# EAGLE schematic 612_jetracer_328_020022 (EAGLE 9.6.2)
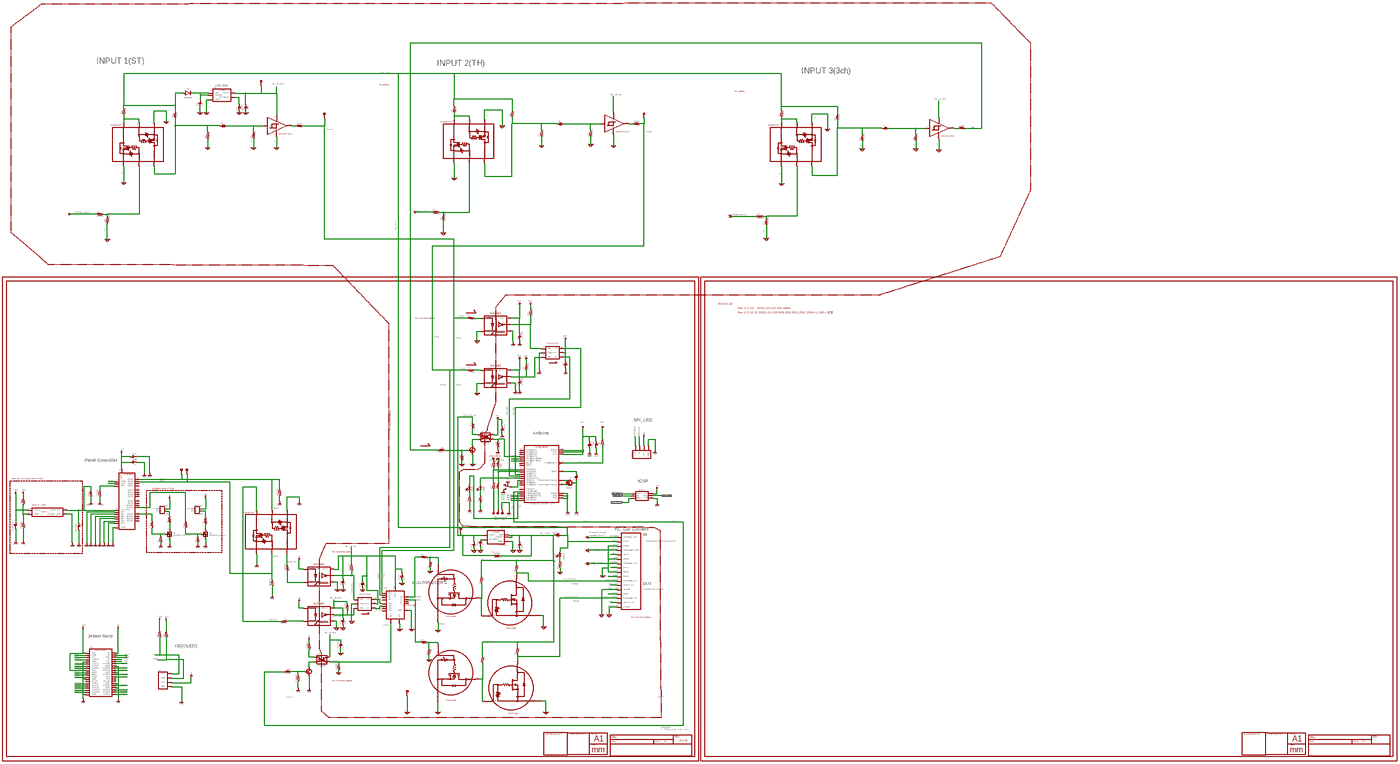
[diagram p0: schematic, sheet 1, overview]
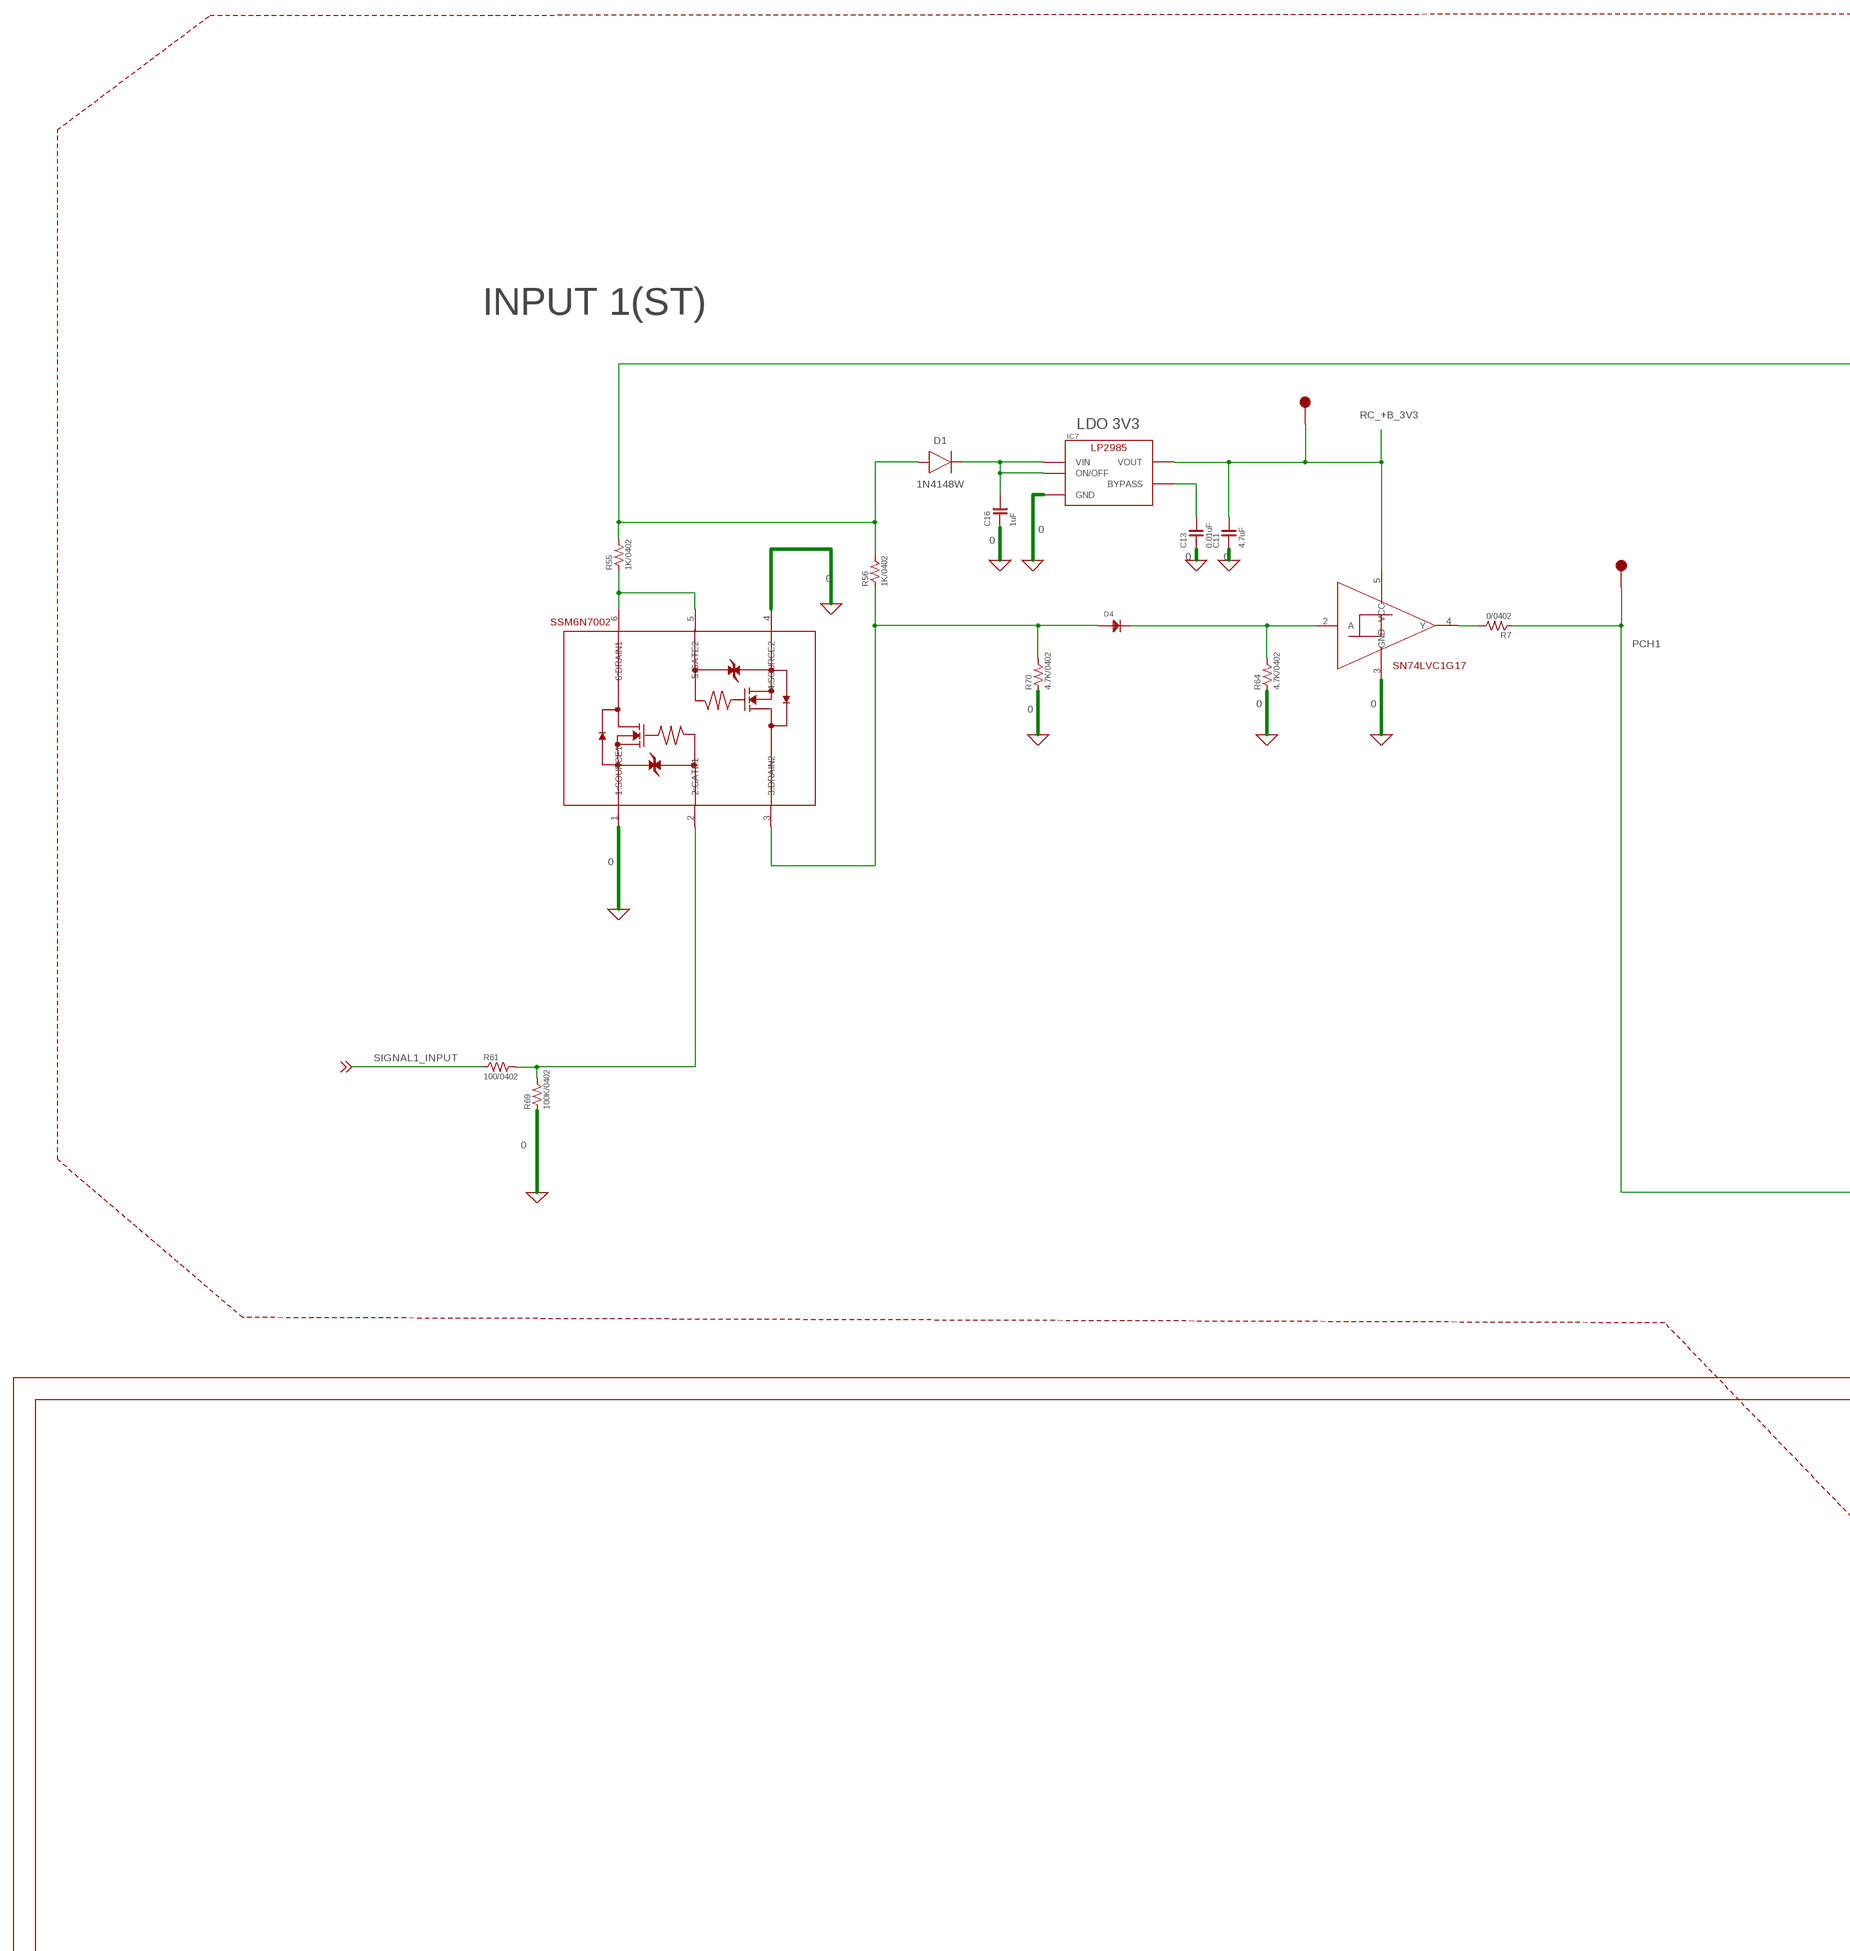
[diagram p1: schematic, sheet 1, part 1 of 8]
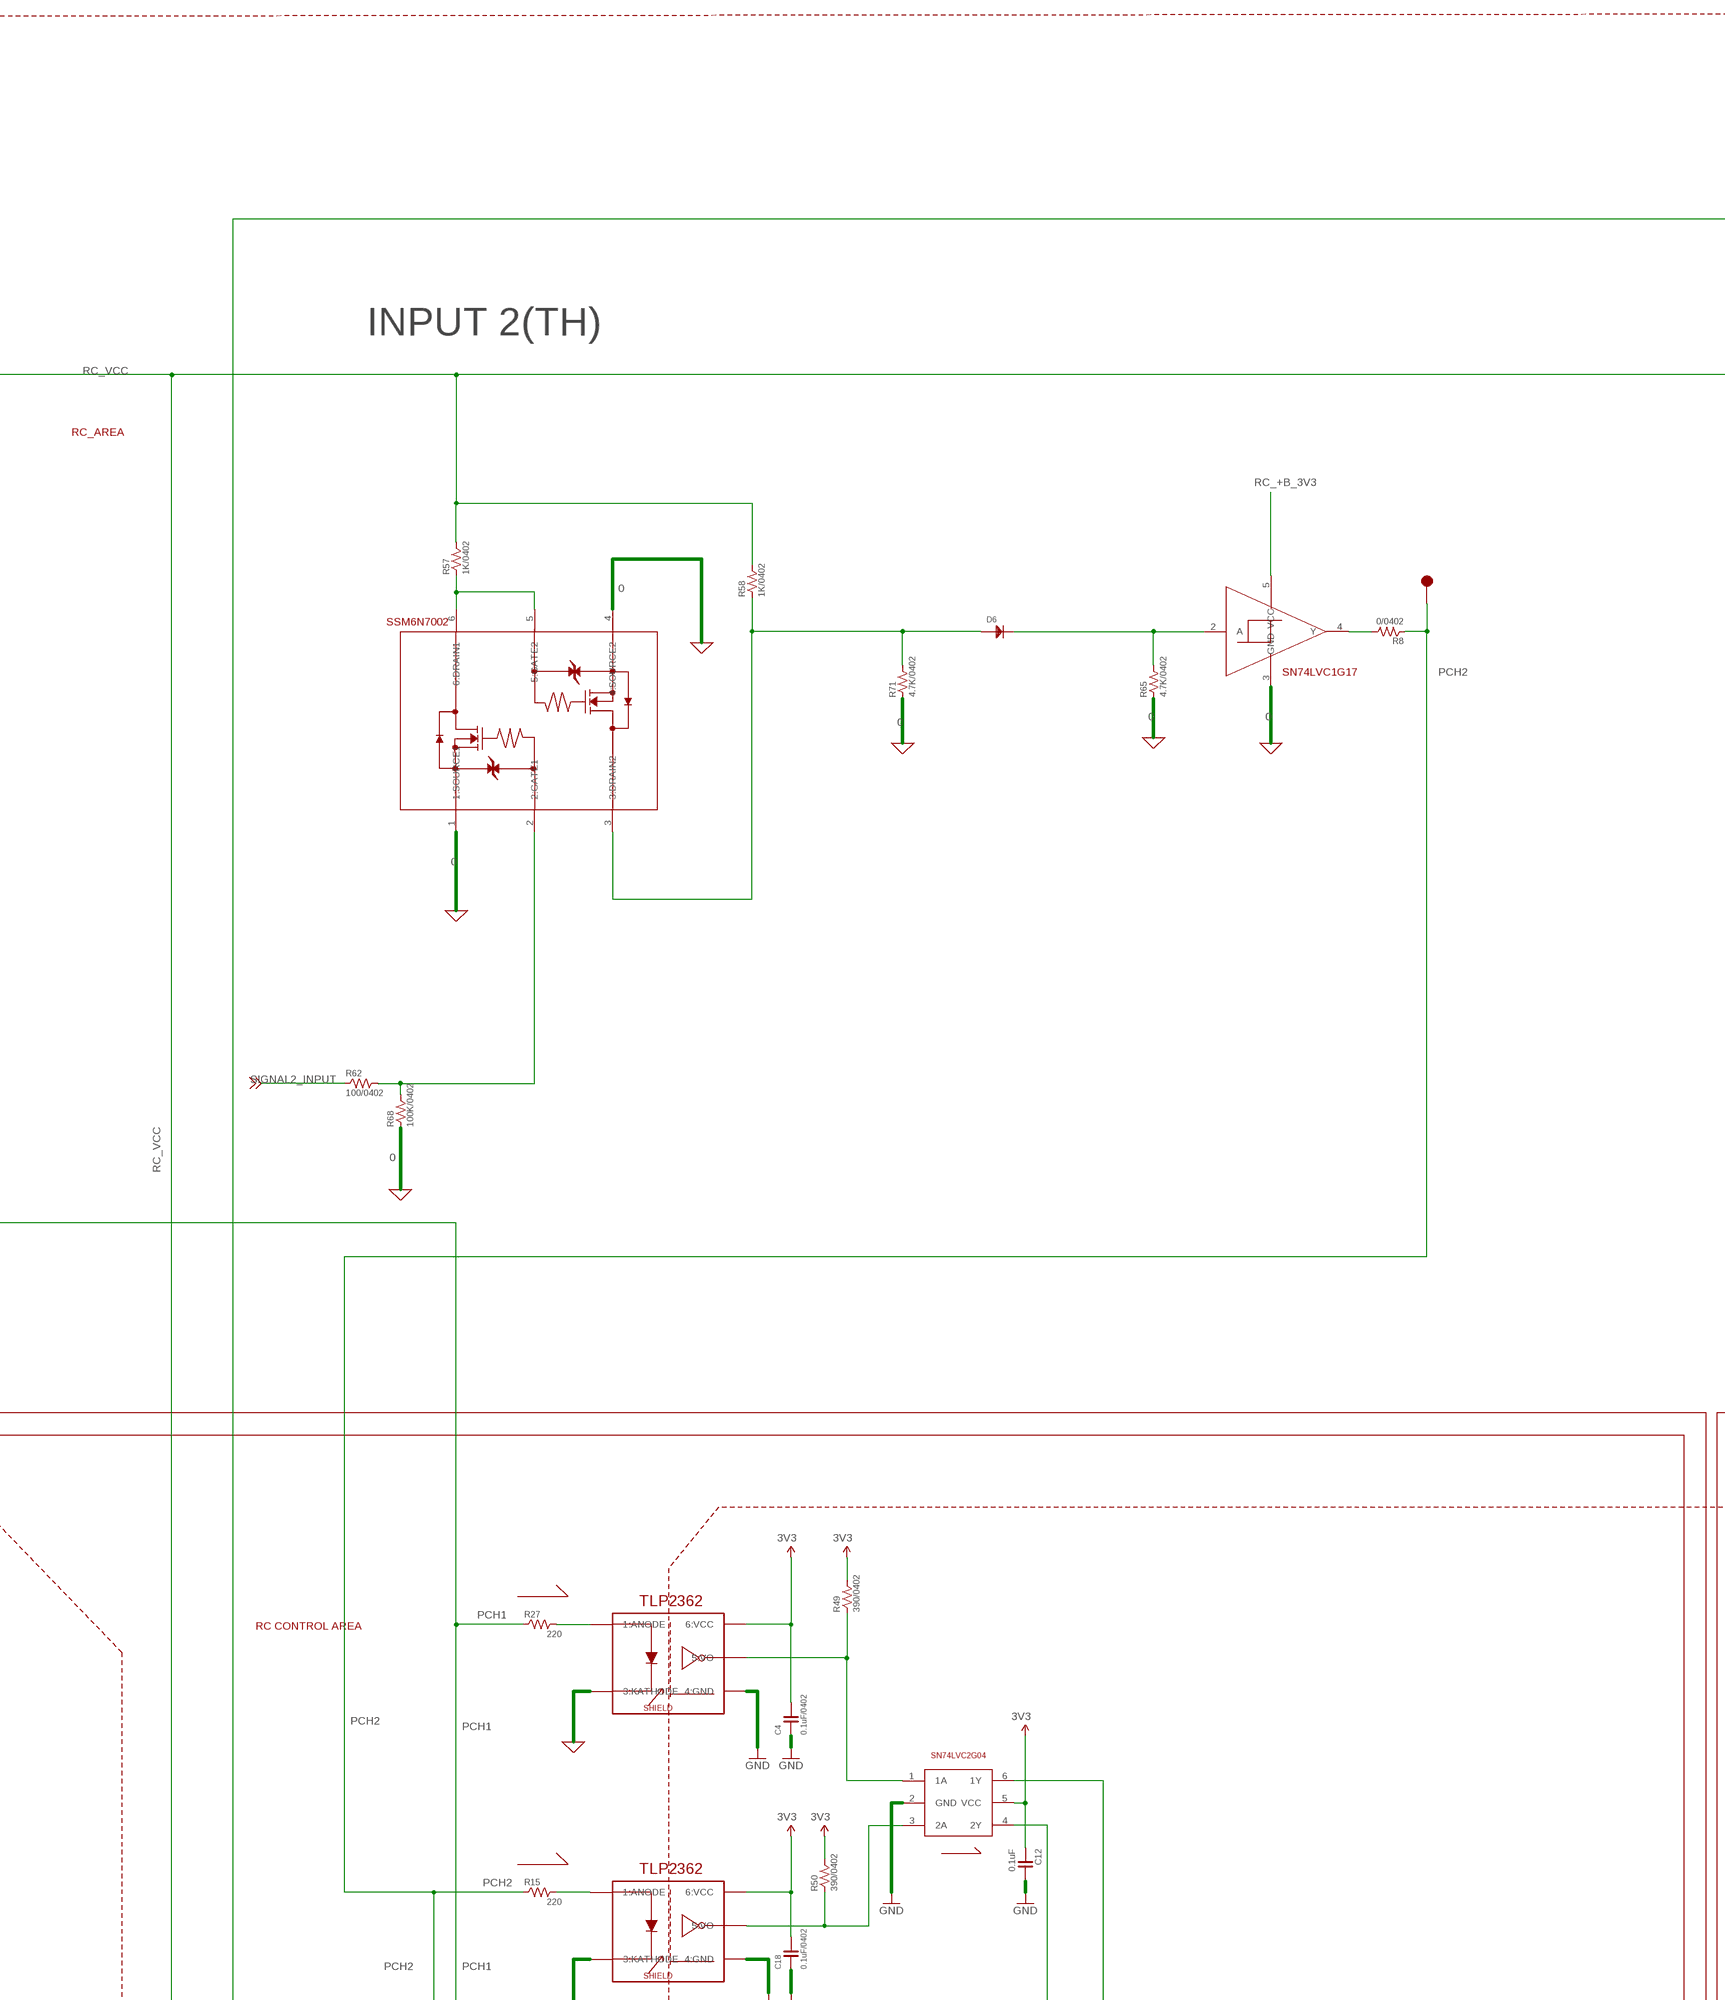
[diagram p2: schematic, sheet 1, part 2 of 8]
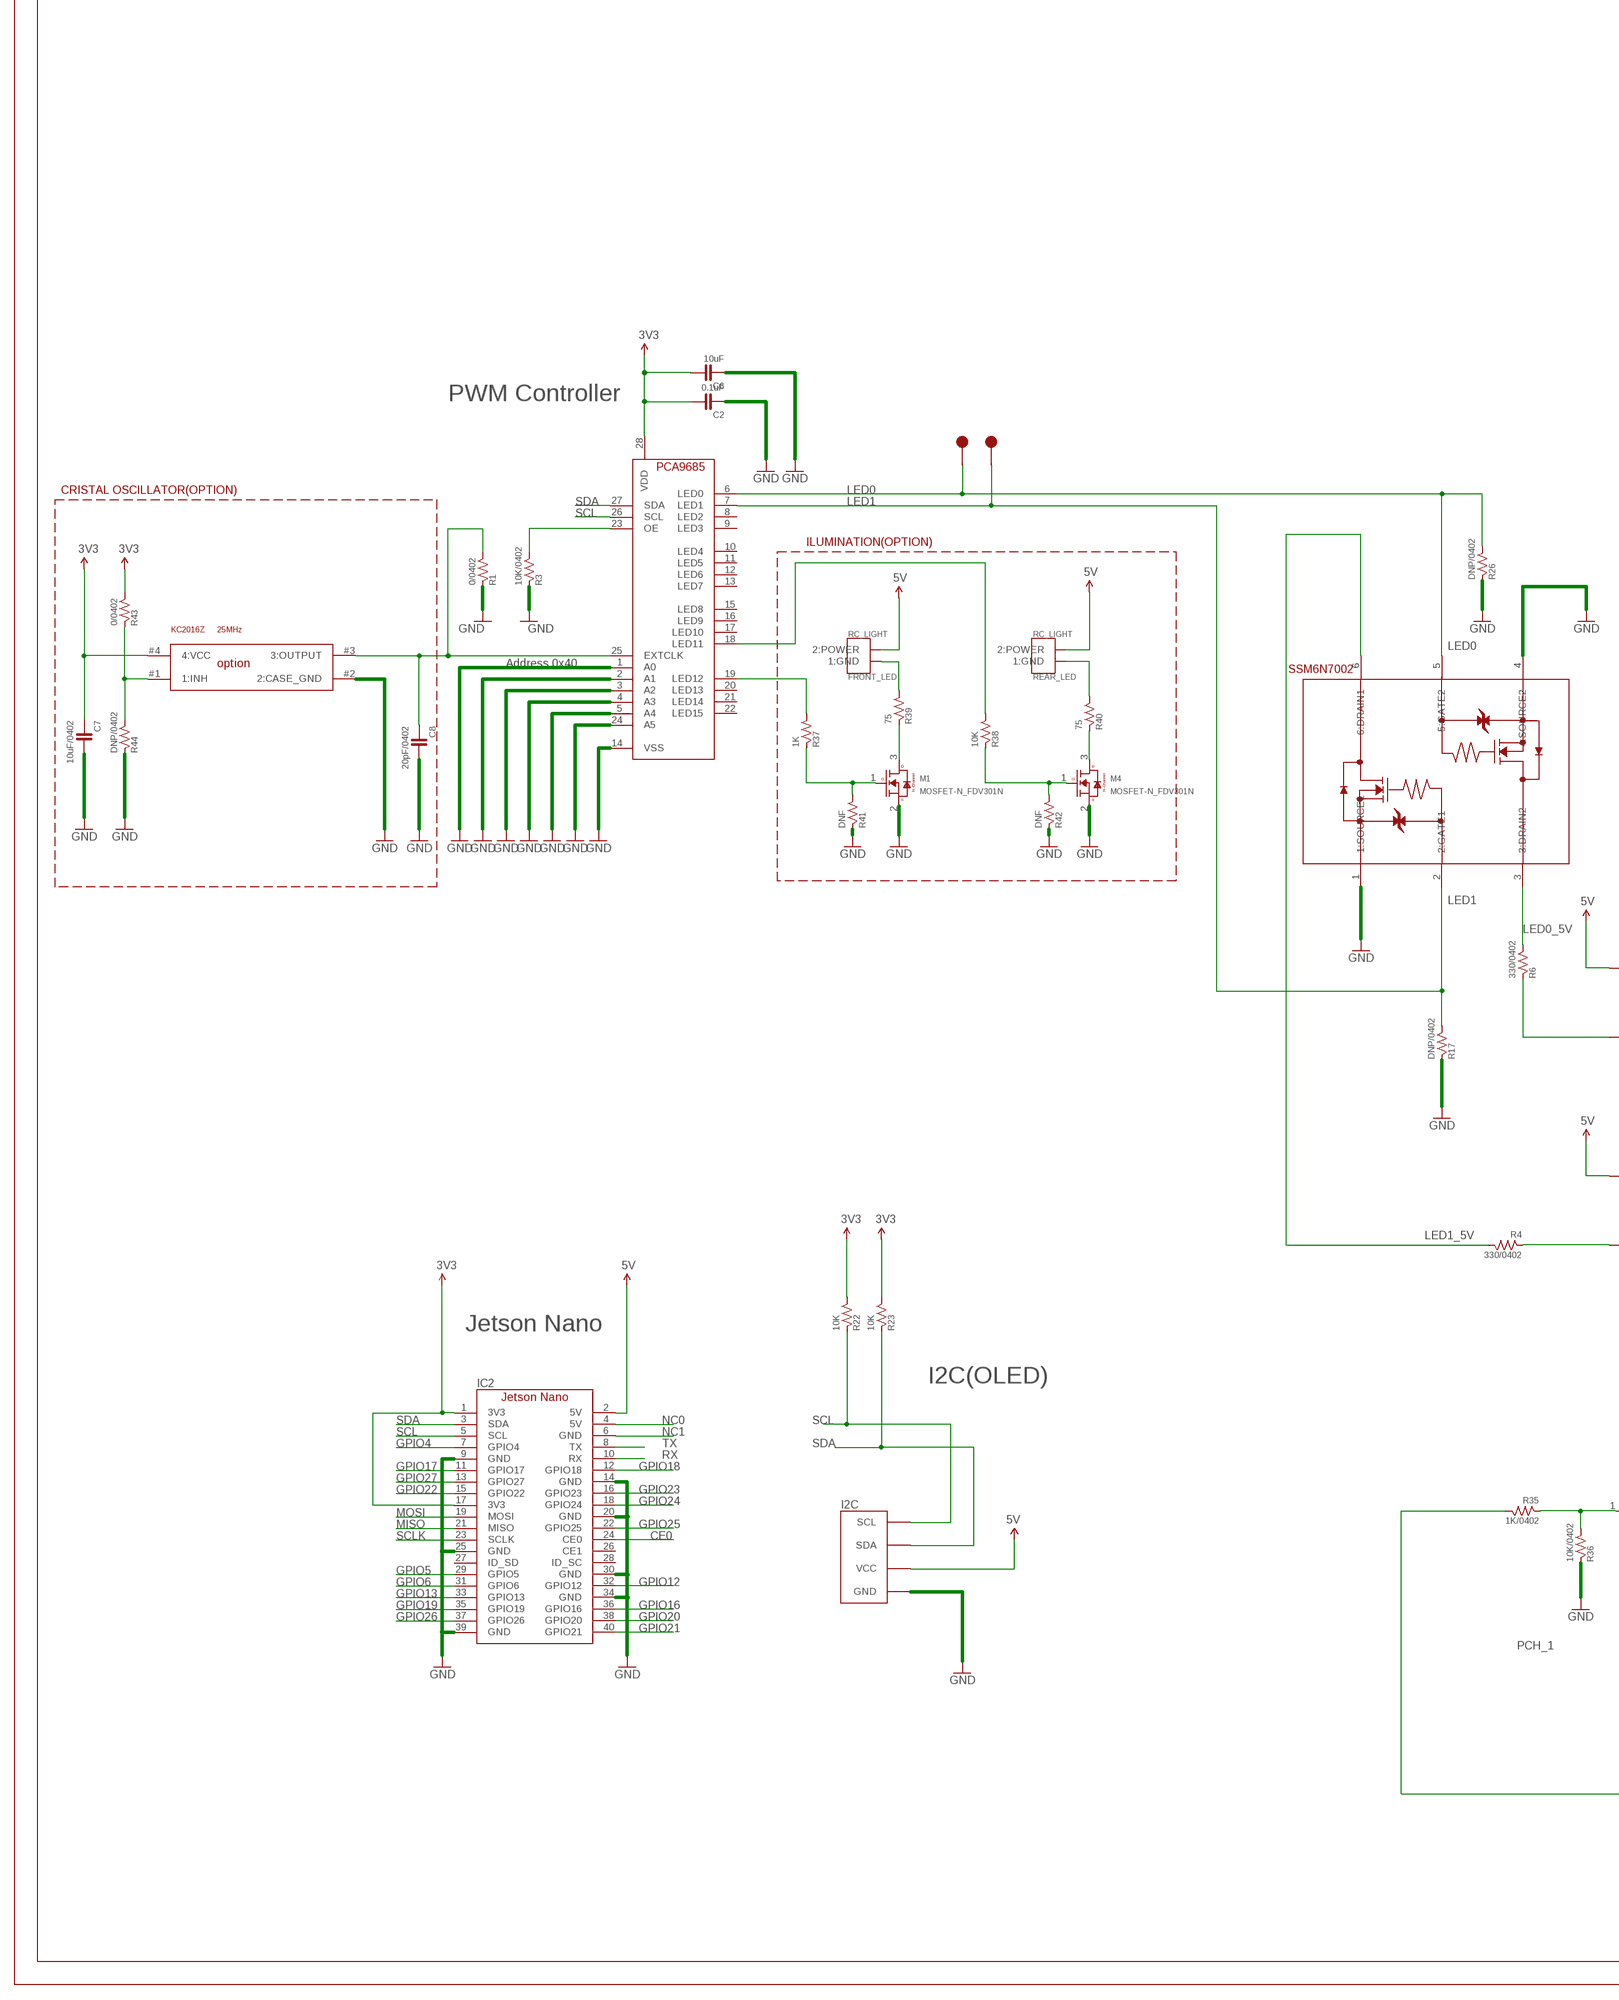
[diagram p3: schematic, sheet 1, part 3 of 8]
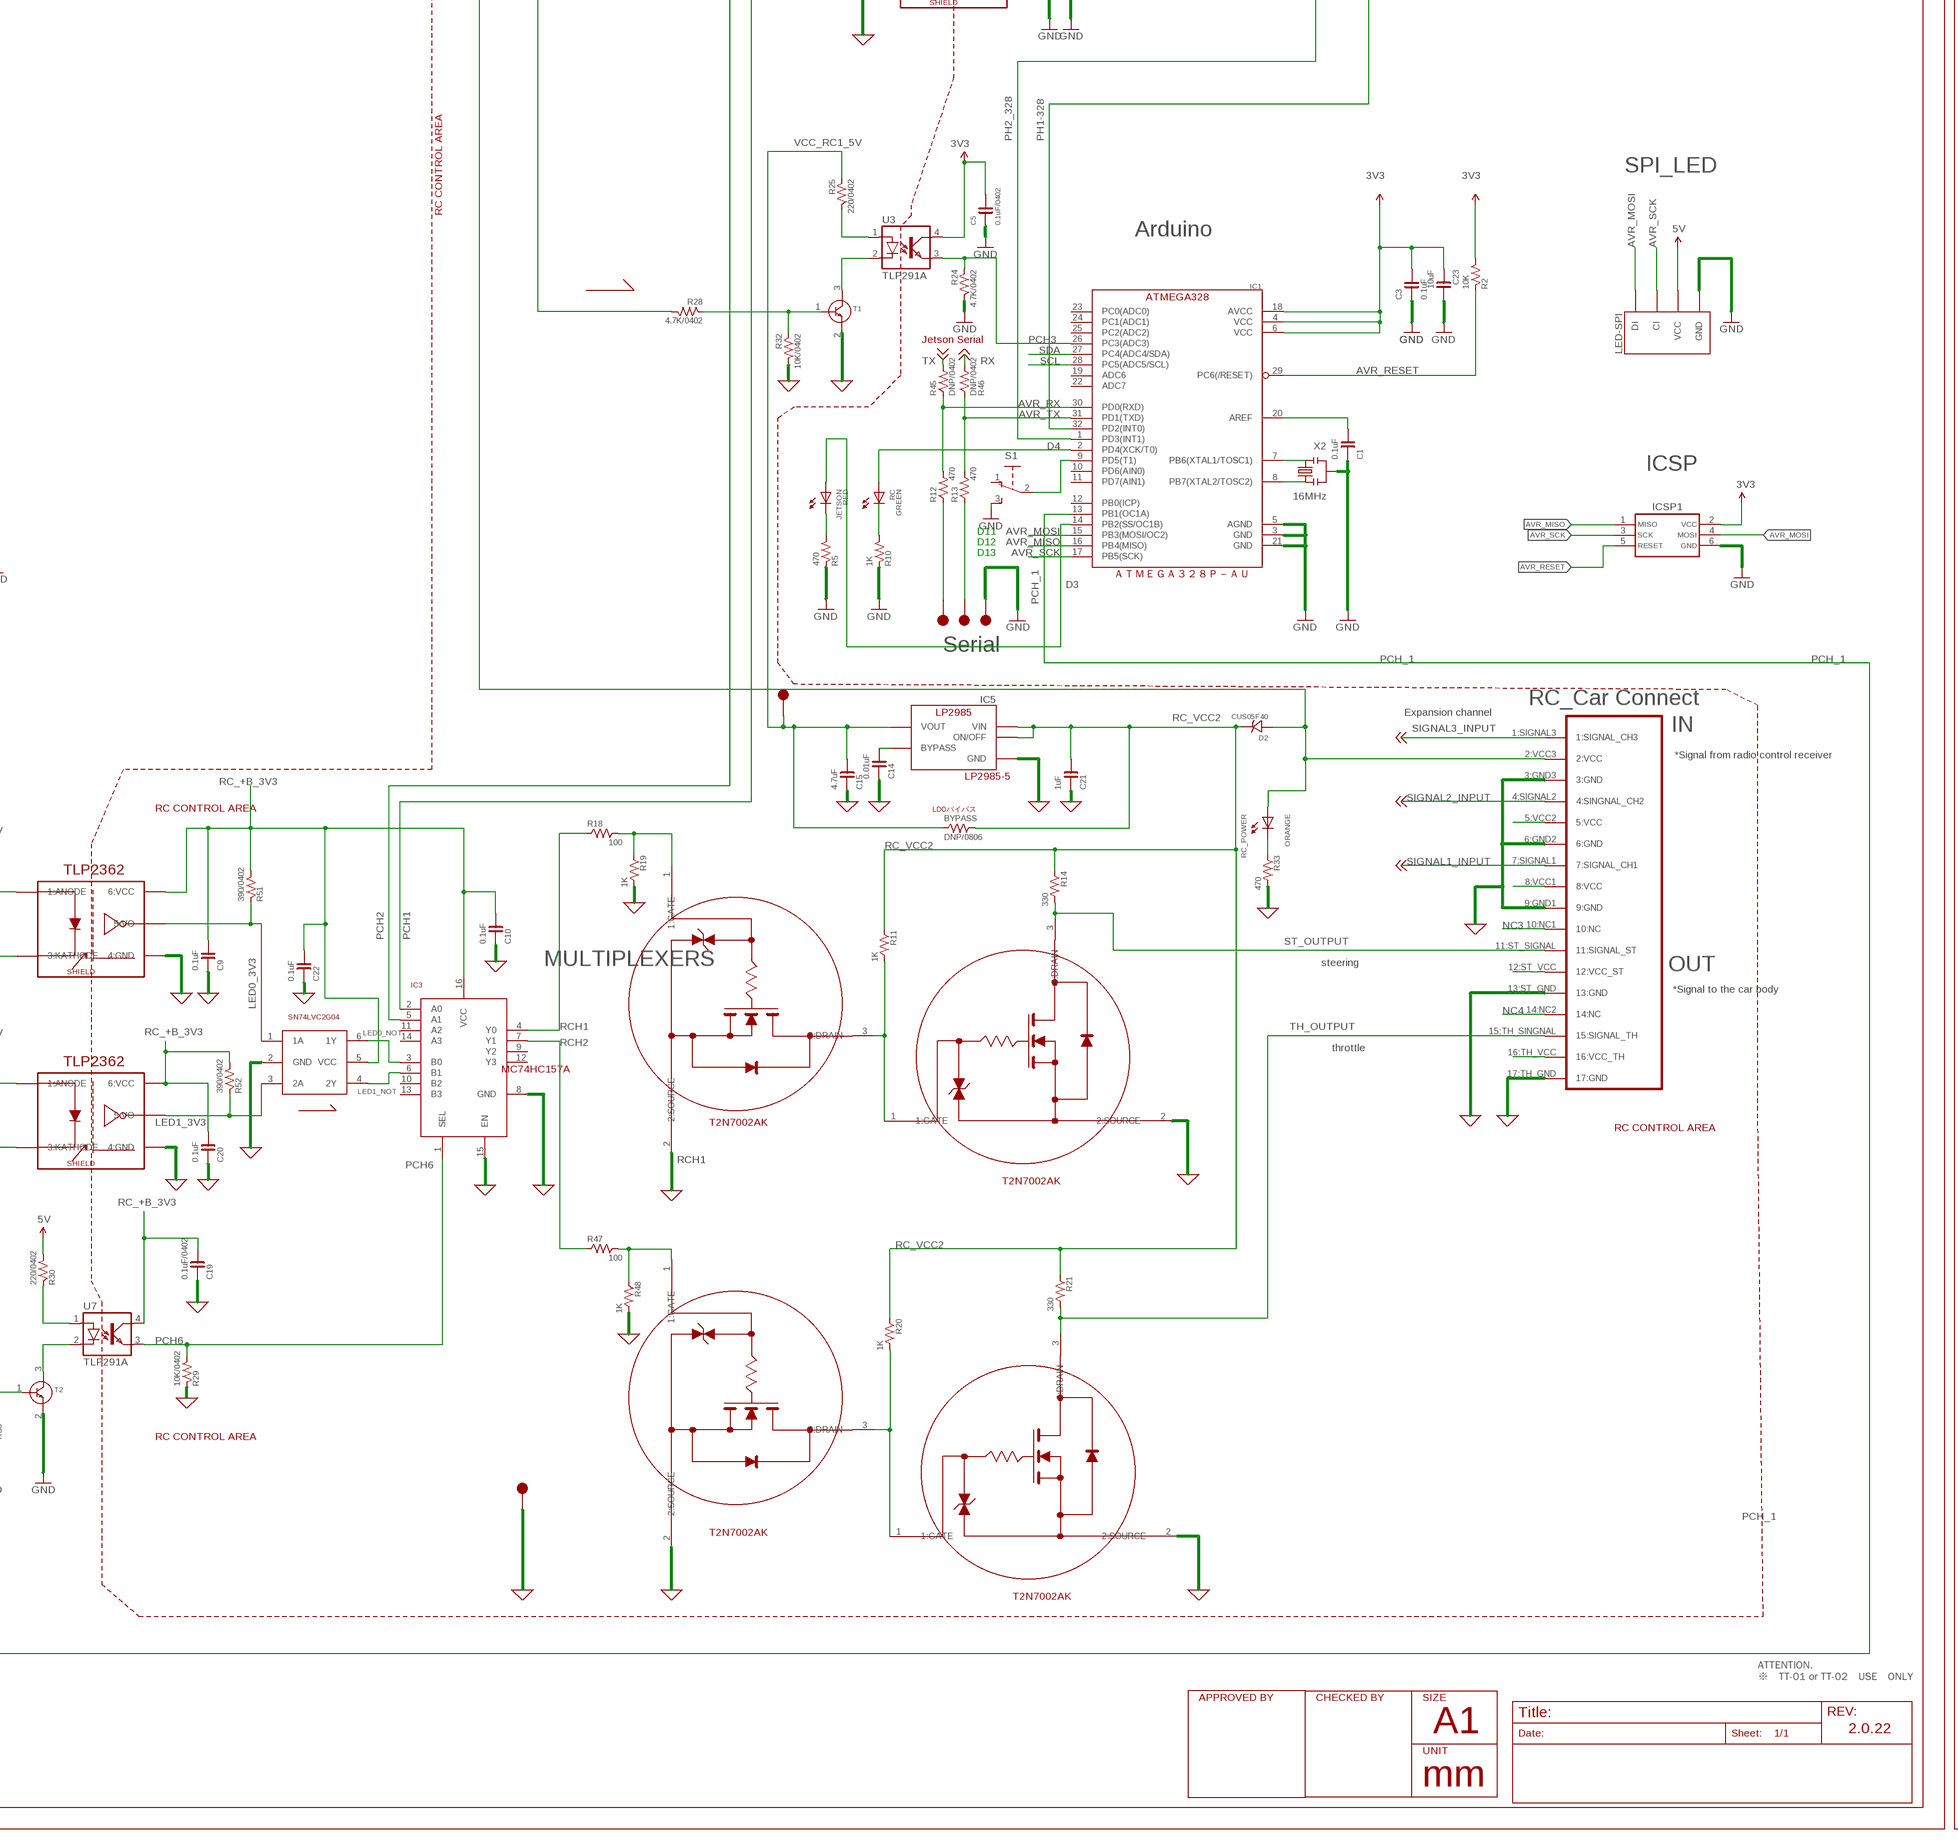
[diagram p4: schematic, sheet 1, part 4 of 8]
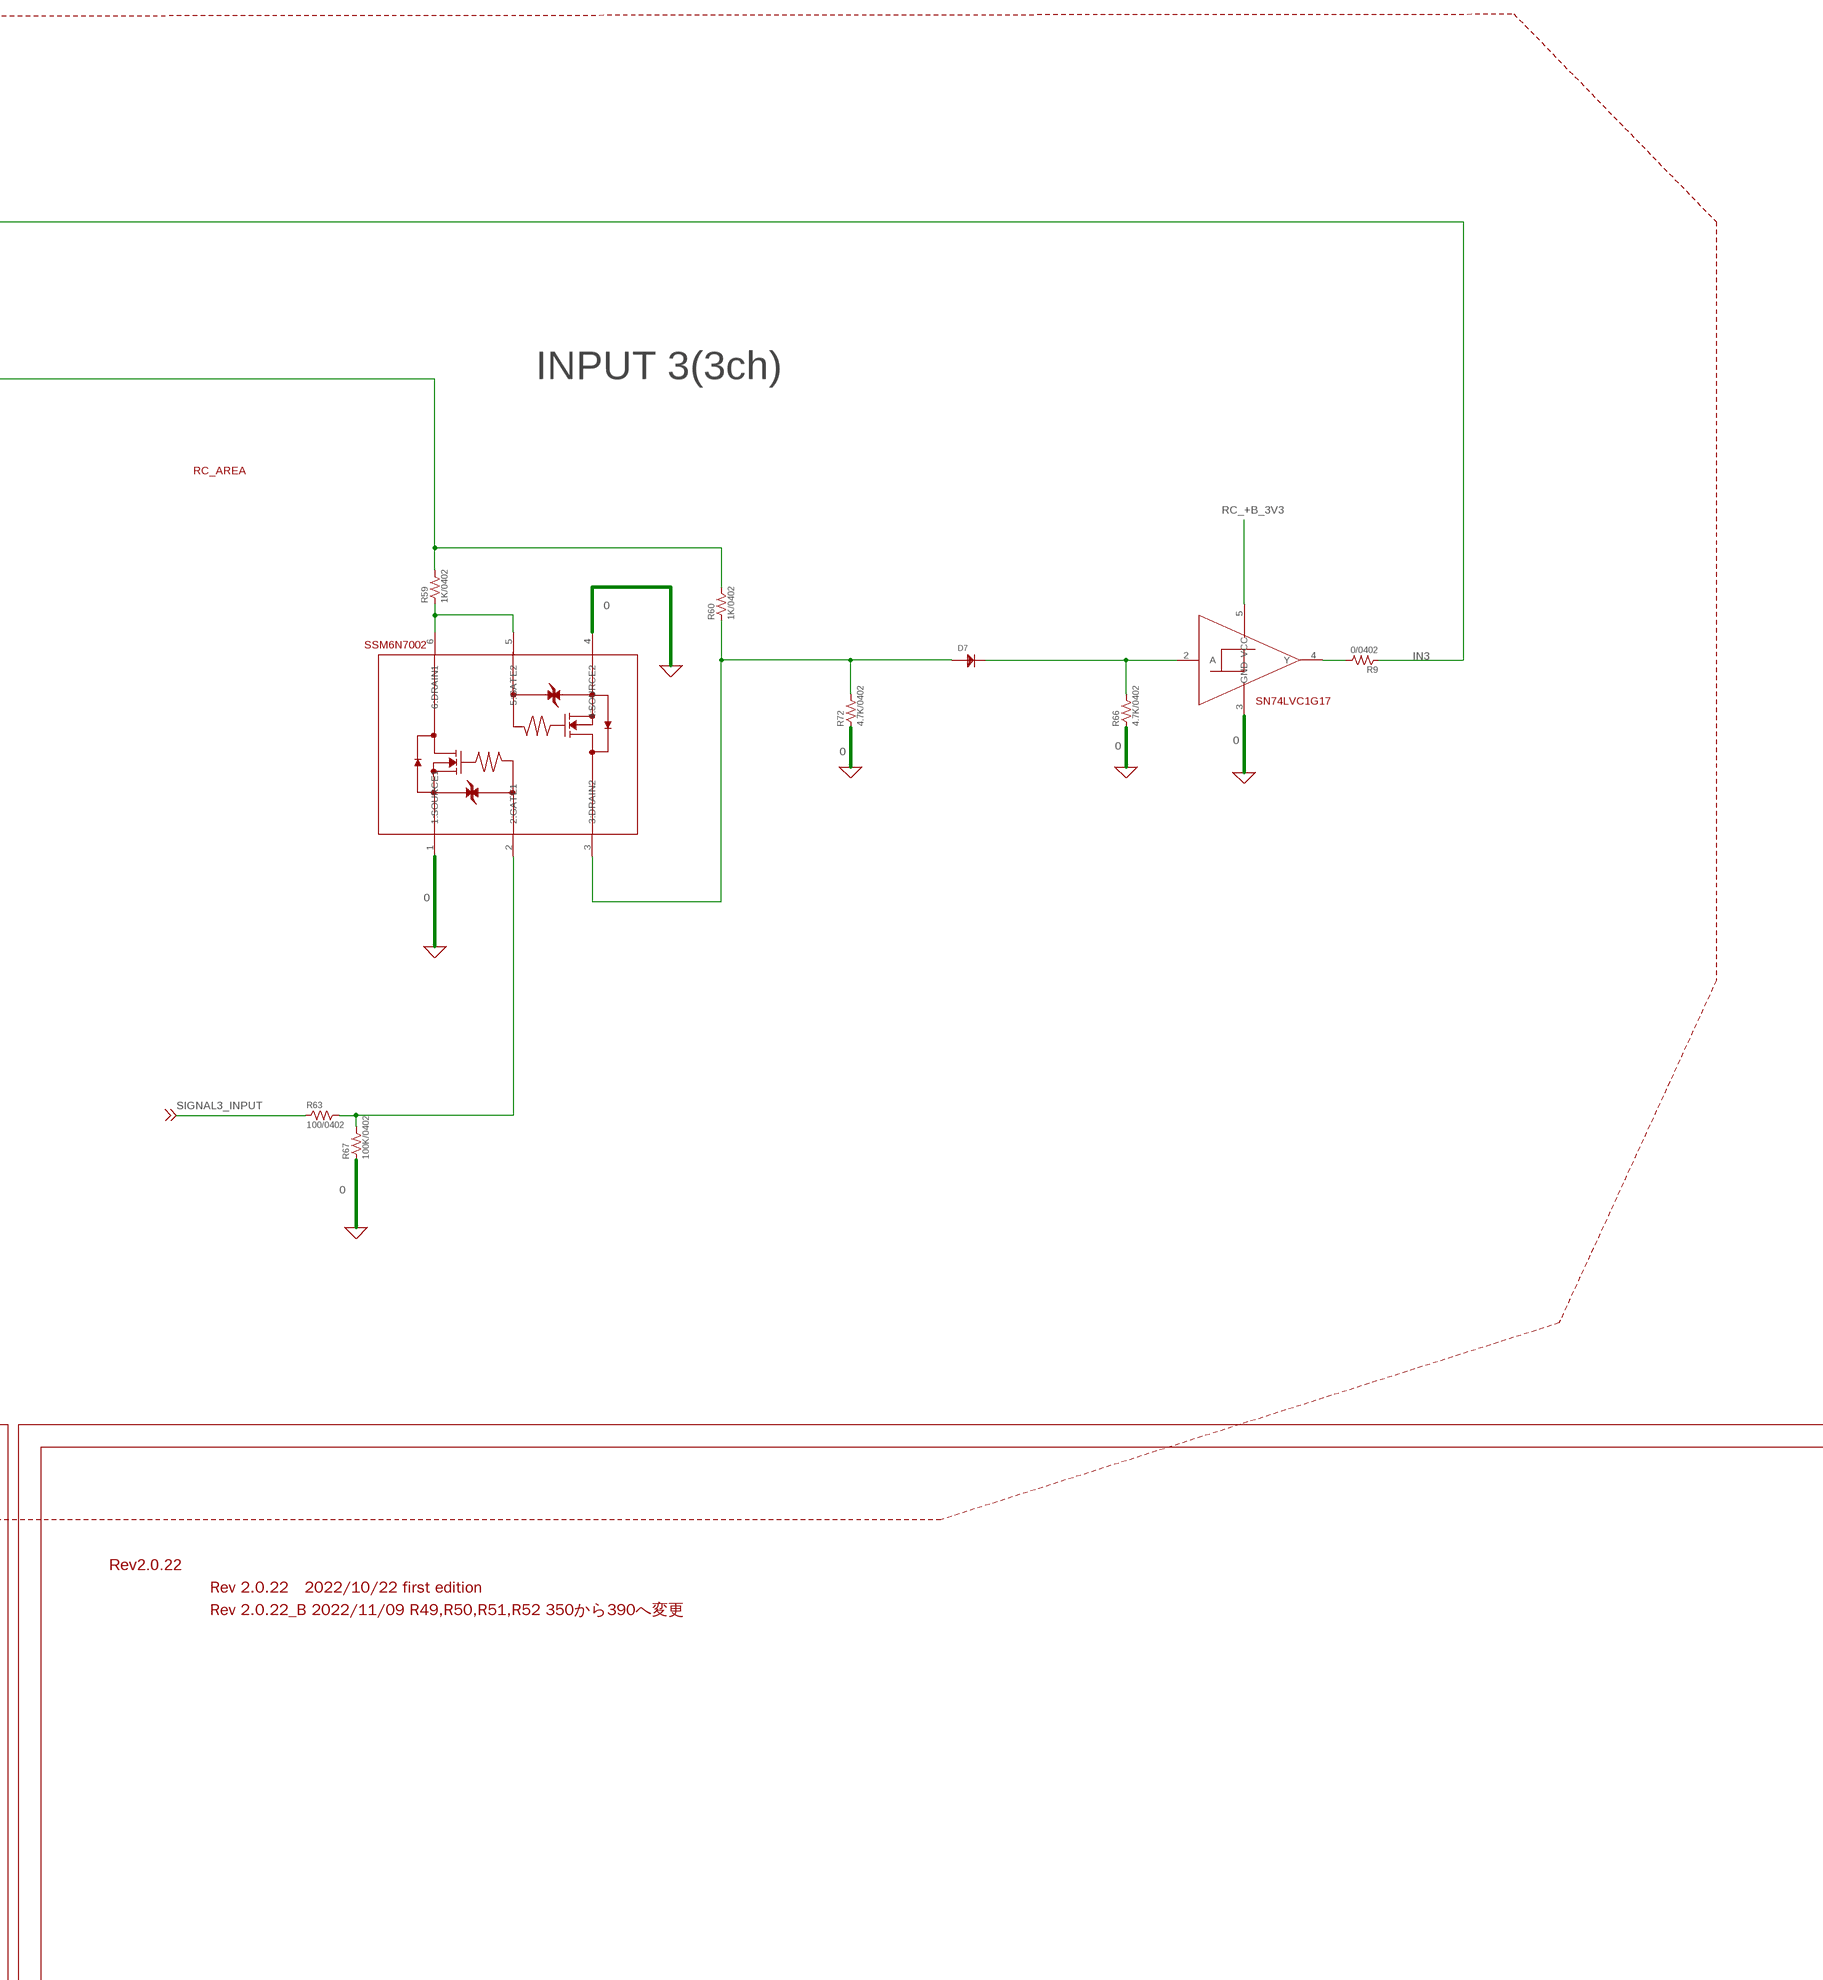
[diagram p5: schematic, sheet 1, part 5 of 8]
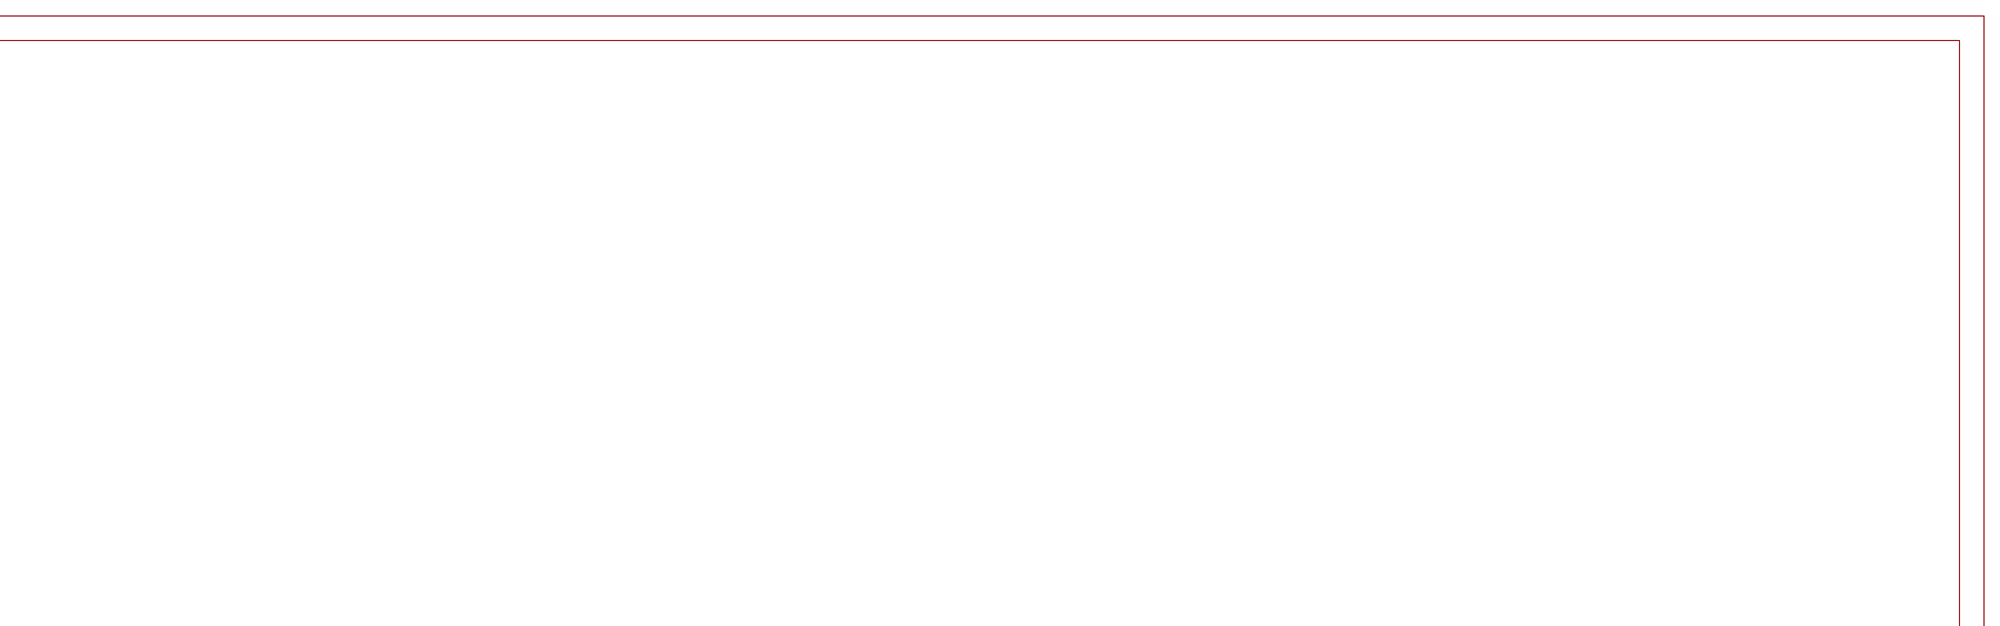
[diagram p6: schematic, sheet 1, part 6 of 8]
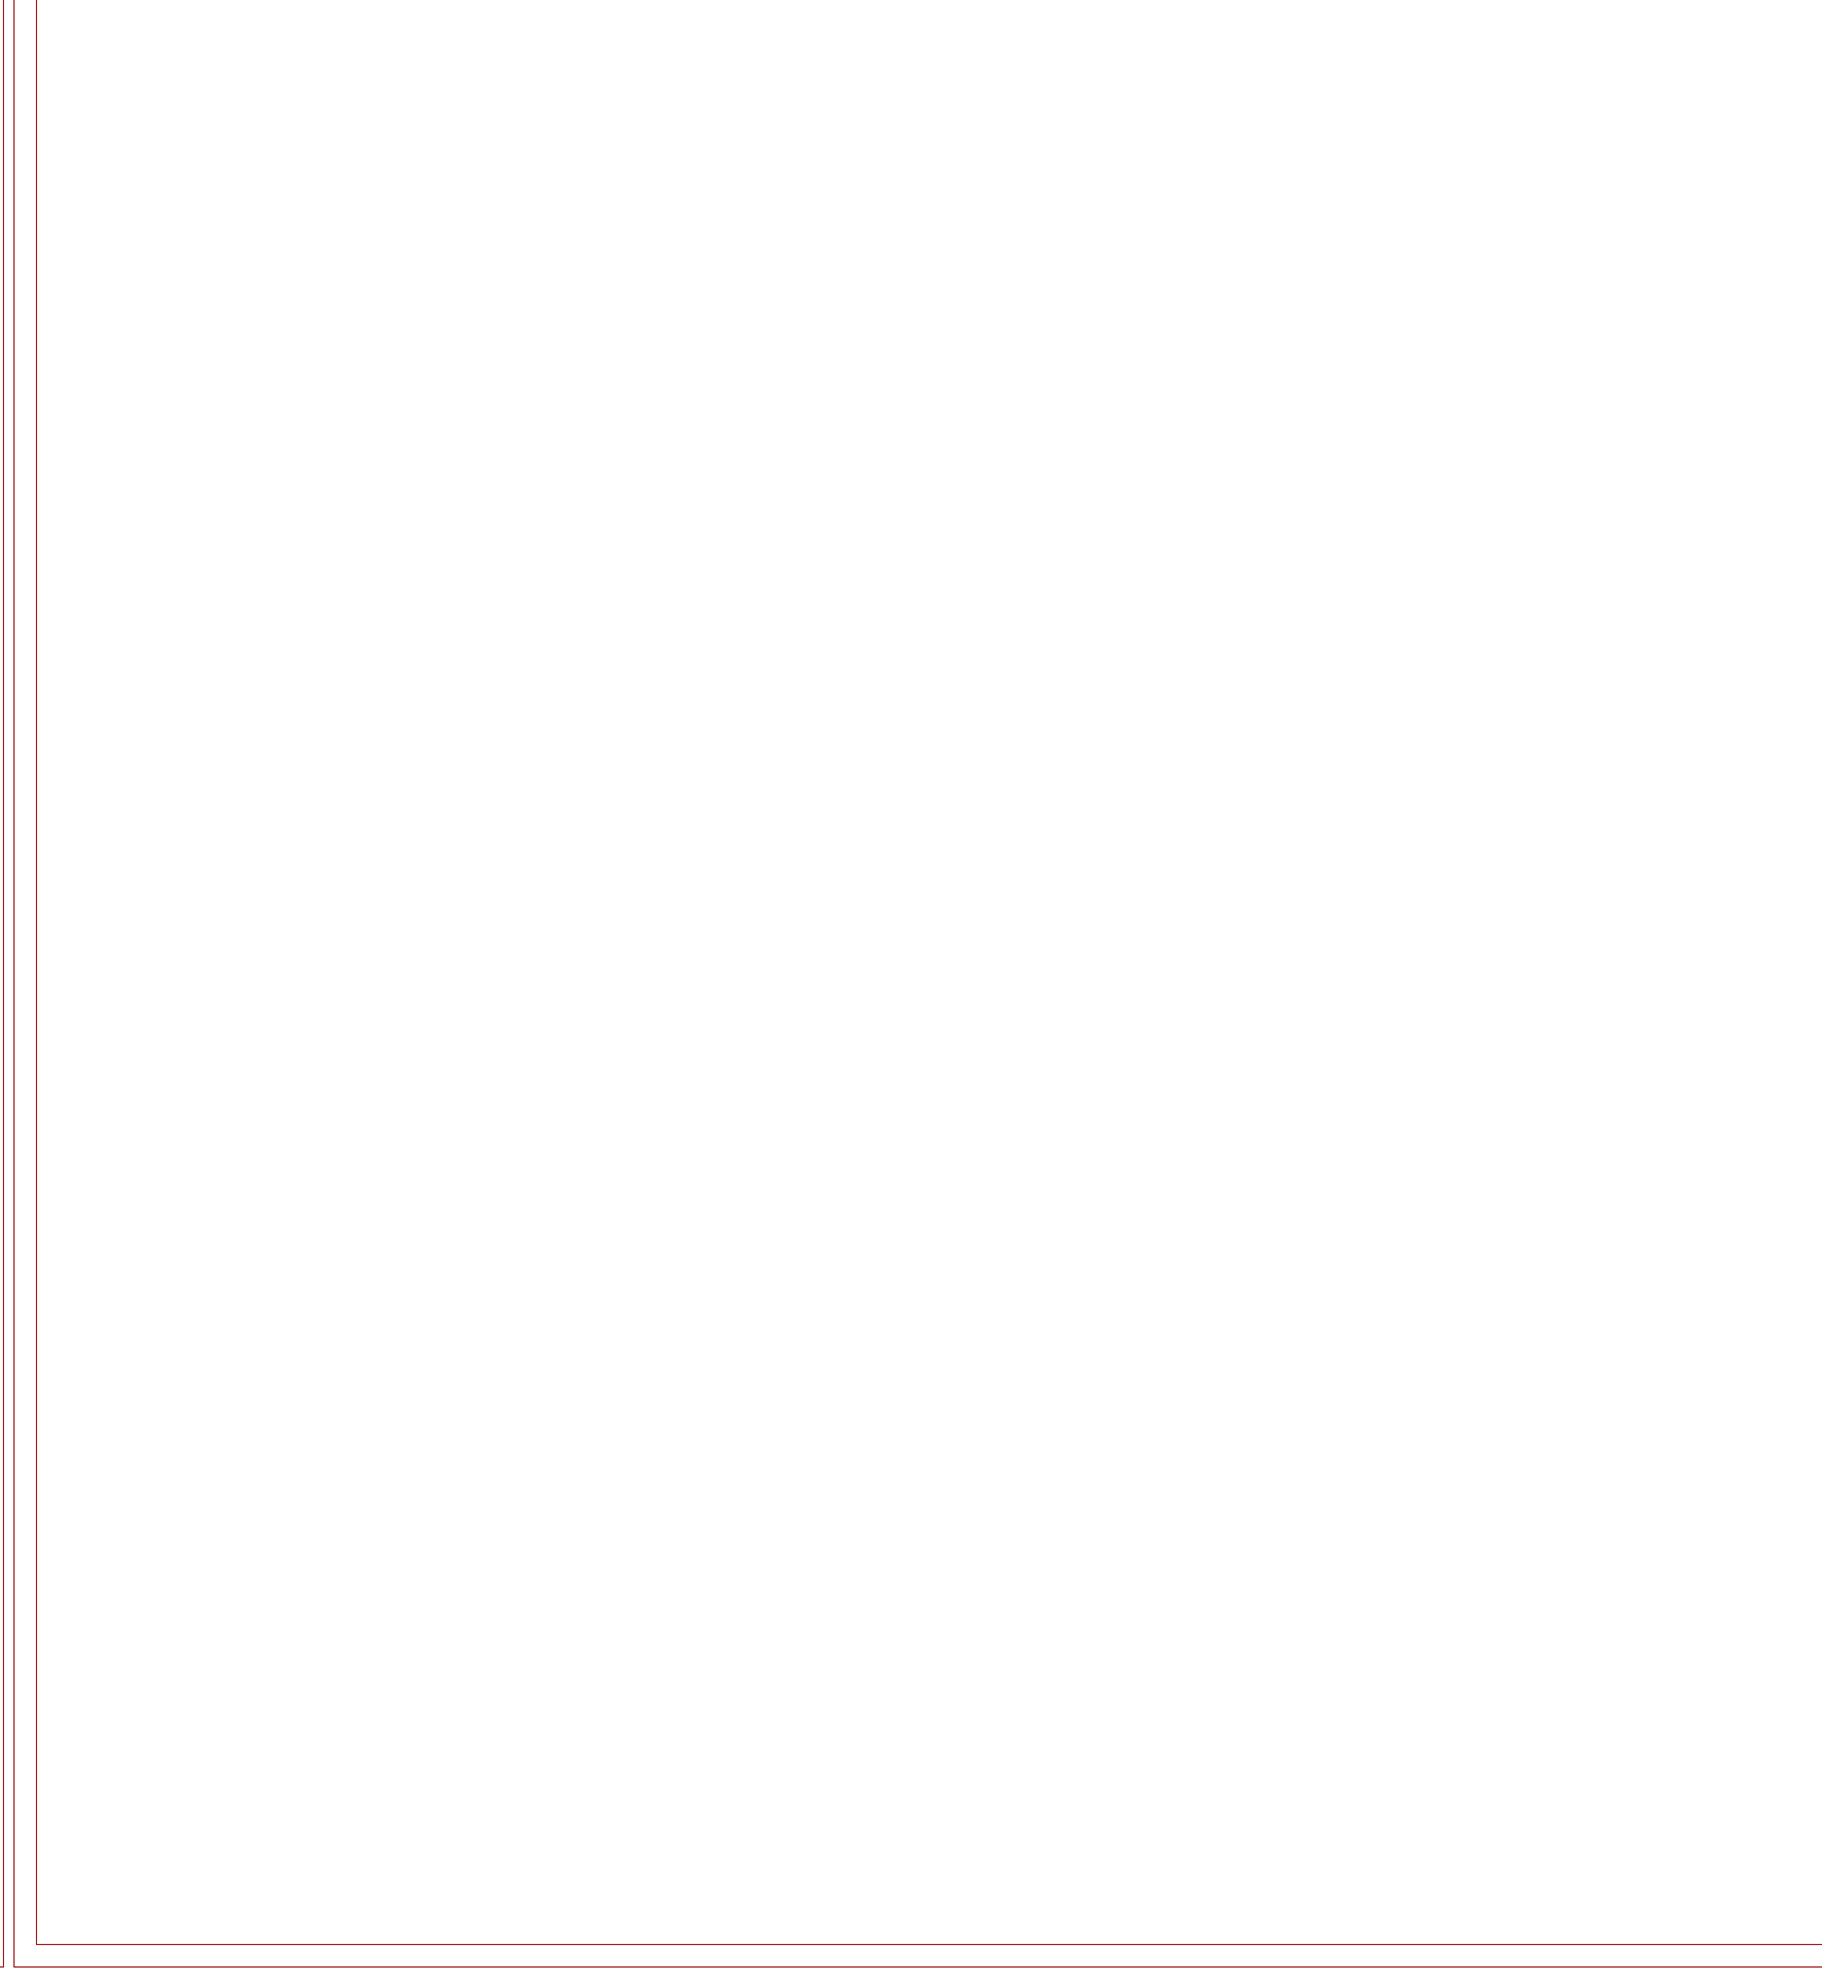
[diagram p7: schematic, sheet 1, part 7 of 8]
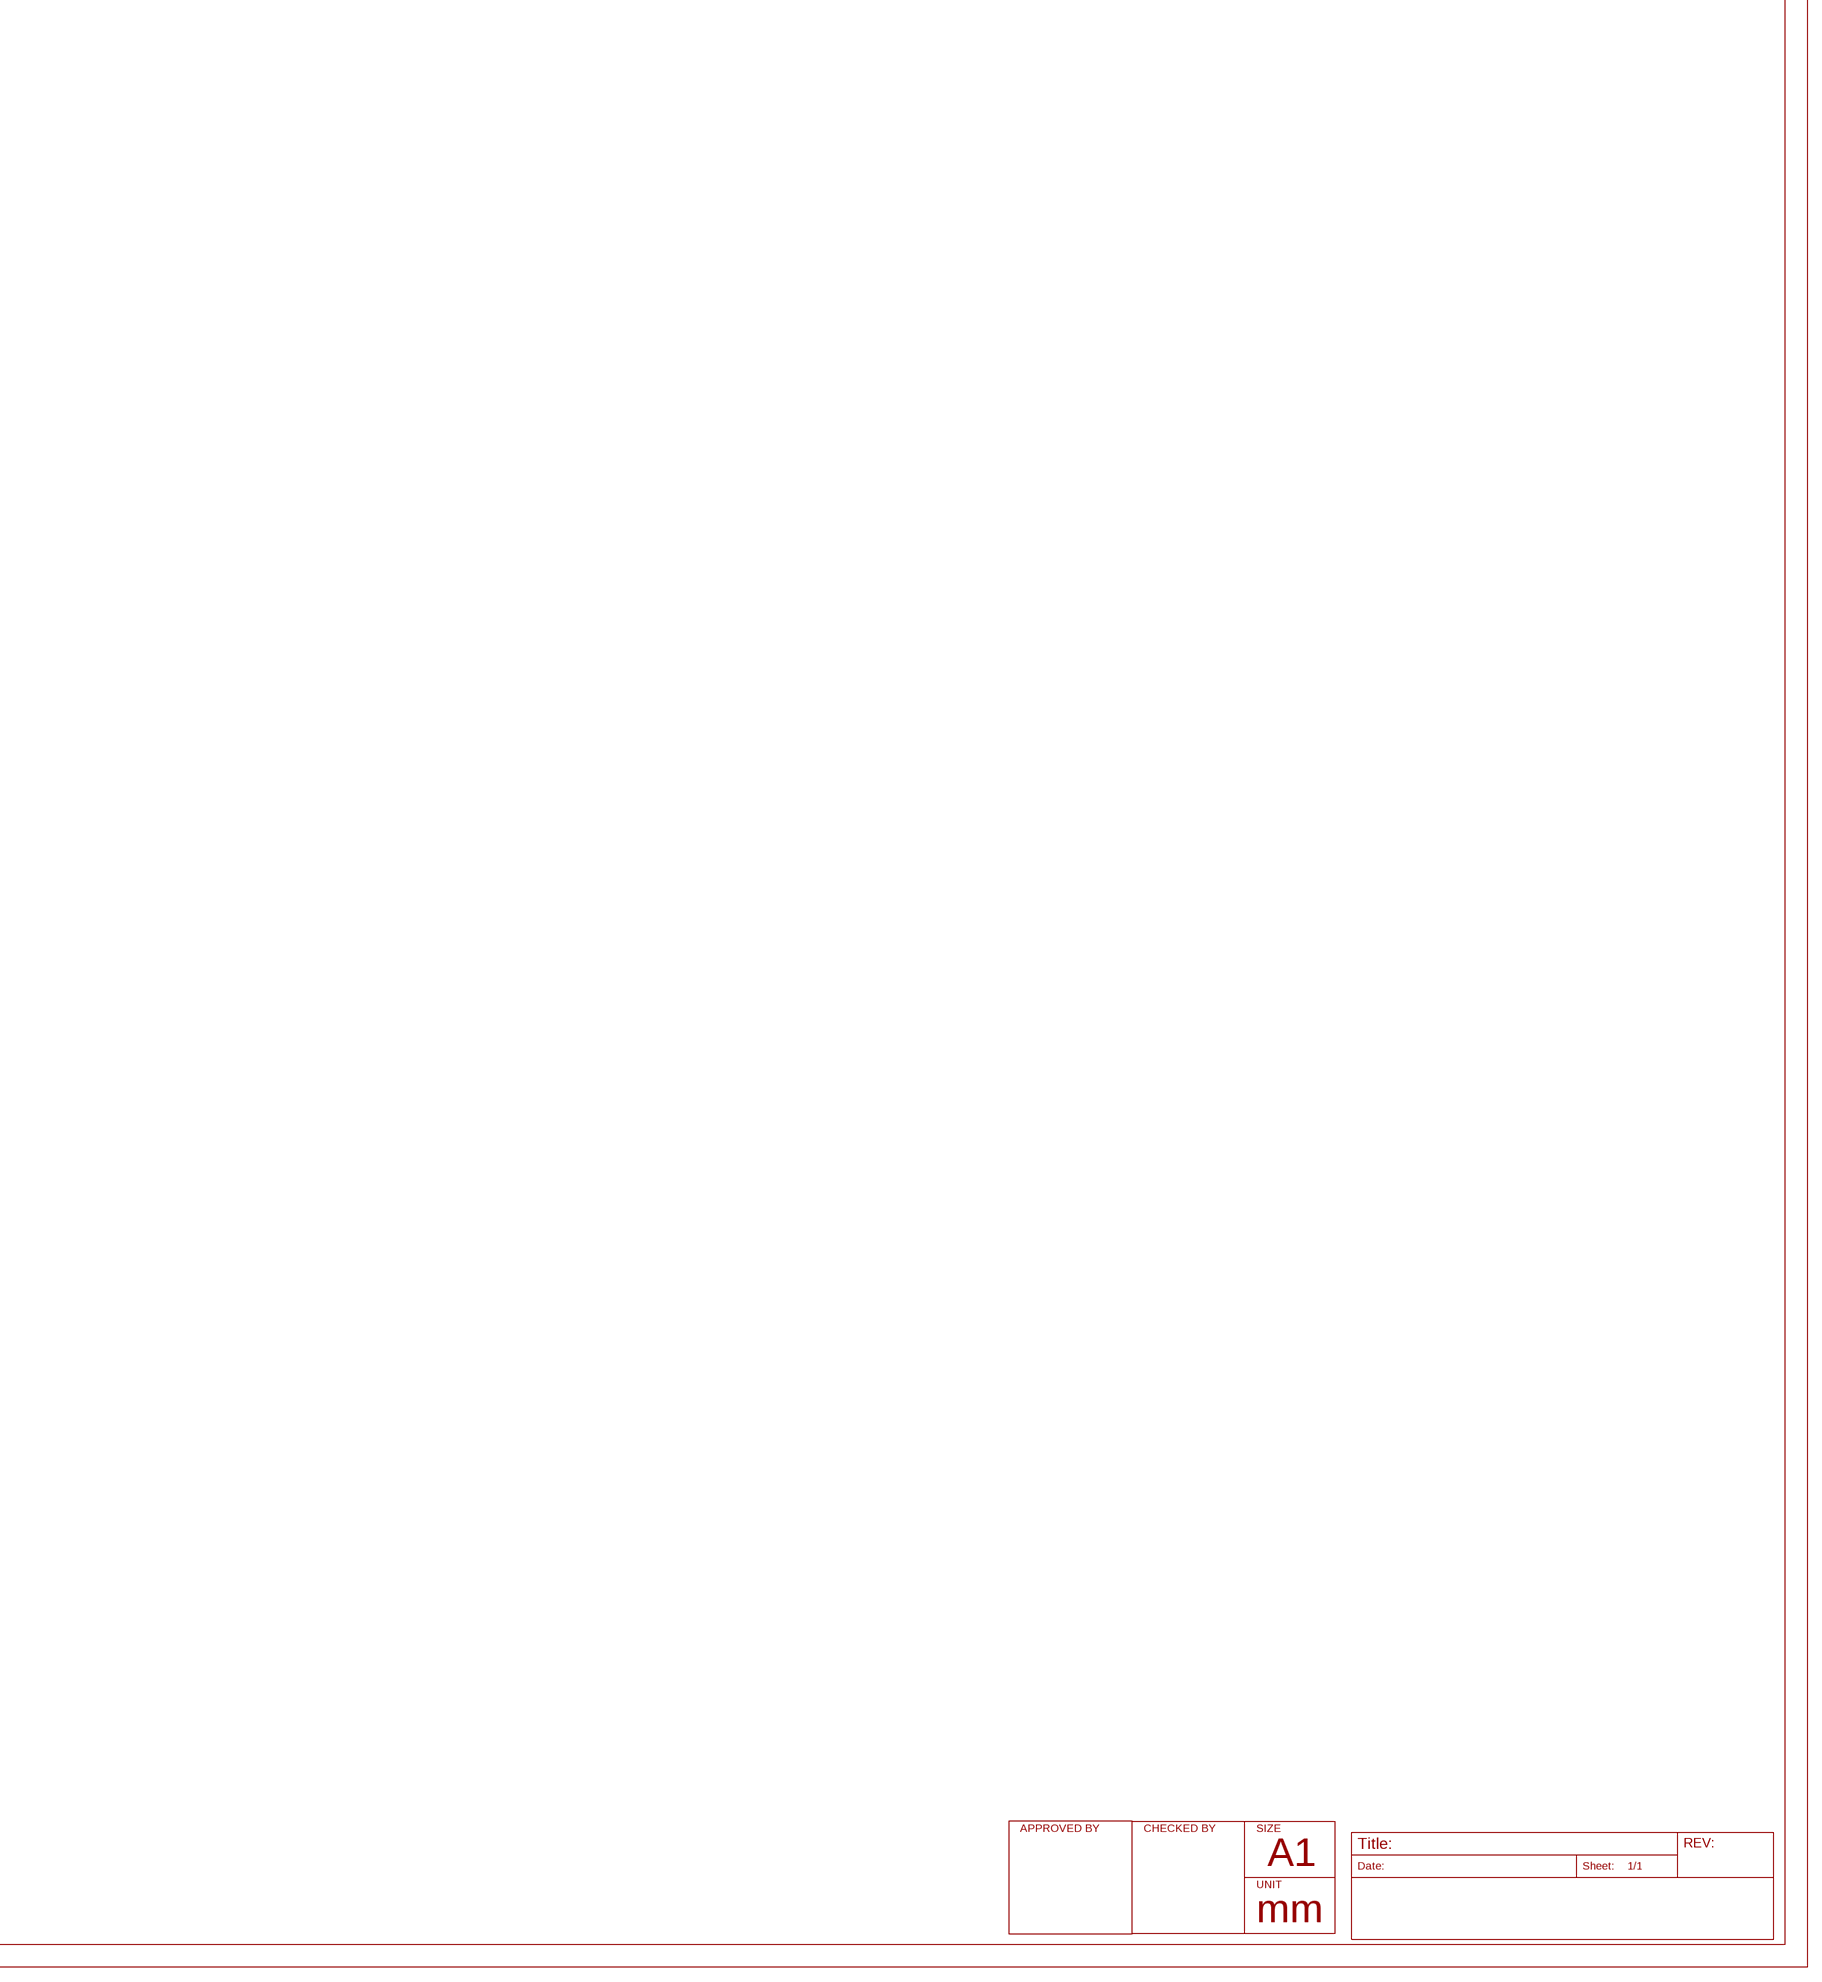
[diagram p8: schematic, sheet 1, part 8 of 8]

## Parts
BYPASS  DNP/0806  RESISTOR-0805  [0805]
C1  0.1uF  CAPACITOR-0603  [0603]
C2  0.1uF  CAPACITOR-0603  [0603]
C3  0.1uF  CAPACITOR-0402  [0402]
C4  0.1uF/0402  CAPACITOR-0402  [0402]
C5  0.1uF/0402  CAPACITOR-0402  [0402]
C6  10uF  CAPACITOR-0603  [0603]
C7  10uF/0402  CAPACITOR-0402  [0402]
C8  20pF/0402  CAPACITOR-0402  [0402]
C9  0.1uF  CAPACITOR-0603  [0603]
C10  0.1uF  CAPACITOR-0603  [0603]
C11  4.7uF  CAPACITOR-0603  [0603]
C12  0.1uF  CAPACITOR-0603  [0603]
C13  0.01uF  CAPACITOR-0603  [0603]
C14  0.01uF  CAPACITOR-0603  [0603]
C15  4.7uF  CAPACITOR-0603  [0603]
C16  1uF  CAPACITOR-0603  [0603]
C18  0.1uF/0402  CAPACITOR-0402  [0402]
C19  0.1uF/0402  CAPACITOR-0402  [0402]
C20  0.1uF  CAPACITOR-0603  [0603]
C21  1uF  CAPACITOR-0603  [0603]
C22  0.1uF  CAPACITOR-0603  [0603]
C23  10uF  CAPACITOR-0603  [0603]
D1  1N4148W  DIODE_1N4148W-7-F_SOD123G  [SOD3715X135]
D2  CUS05F40  [CUS05F40]
D4  DIODE-SOD-323  [SOD-323]
D6  DIODE-SOD-323  [SOD-323]
D7  DIODE-SOD-323  [SOD-323]
FRONT_LED  RC_LIGHT  [PNHEADER_2.54_SMT_LEDLIGHT]
I2C  FABO-I2C_BM04B  [I2C-BM04B-PASS-1]
IC1  ATMEGA328P-AU  [TQFP-32]
IC2  JETSON_NANO_NOBORDER  [JETSON_NANO_NOBOARDER]
IC3  MULTIPLEXERSMC74HC157A  [TSSOP-16]
IC4  PCA9685_BOTTOM  [PCA9685_BOTTOM]
IC5  LP2985-33DBV  [SOT-23-5]
IC7  LP2985-33DBV  [SOT-23-5]
ICSP1  ICSP_AVR-TC_NOHOLE  [TC2030]
JETSON  GREEN  LED-0603  [0603]
LED-SPI  FABO-SPI-LED-BM04B  [SPI-BM04B-PASS-1]
M1  MOSFET-N_FDV301N  [SOT-23]
M4  MOSFET-N_FDV301N  [SOT-23]
R1  0/0402  RESISTOR-0402  [0402]
R2  10K  RESISTOR-0603  [0603]
R3  10K/0402  RESISTOR-0402  [0402]
R4  330/0402  RESISTOR-0402  [0402]
R5  470  RESISTOR-0603  [0603]
R6  330/0402  RESISTOR-0402  [0402]
R7  0/0402  RESISTOR-0402  [0402]
R8  0/0402  RESISTOR-0402  [0402]
R9  0/0402  RESISTOR-0402  [0402]
R10  1K  RESISTOR-0603  [0603]
R11  1K  RESISTOR-0603  [0603]
R12  470  RESISTOR-0603  [0603]
R13  470  RESISTOR-0603  [0603]
R14  330  RESISTOR-0603  [0603]
R15  220  RESISTOR-0603  [0603]
R17  DNP/0402  RESISTOR-0402  [0402]
R18  100  RESISTOR-0603  [0603]
R19  1K  RESISTOR-0603  [0603]
R20  1K  RESISTOR-0603  [0603]
R21  330  RESISTOR-0603  [0603]
R22  10K  RESISTOR-0603  [0603]
R23  10K  RESISTOR-0603  [0603]
R24  4.7K/0402  RESISTOR-0402  [0402]
R25  220/0402  RESISTOR-0402  [0402]
R26  DNP/0402  RESISTOR-0402  [0402]
R27  220  RESISTOR-0603  [0603]
R28  4.7K/0402  RESISTOR-0402  [0402]
R29  10K/0402  RESISTOR-0402  [0402]
R30  220/0402  RESISTOR-0402  [0402]
R32  10K/0402  RESISTOR-0402  [0402]
R33  470  RESISTOR-0603  [0603]
R35  1K/0402  RESISTOR-0402  [0402]
R36  10K/0402  RESISTOR-0402  [0402]
R37  1K  RESISTOR-0603  [0603]
R38  10K  RESISTOR-0603  [0603]
R39  75  RESISTOR-0603  [0603]
R40  75  RESISTOR-0603  [0603]
R41  DNF  RESISTOR-0603  [0603]
R42  DNF  RESISTOR-0603  [0603]
R43  0/0402  RESISTOR-0402  [0402]
R44  DNP/0402  RESISTOR-0402  [0402]
R45  DNP/0402  RESISTOR-0402  [0402]
R46  DNP/0402  RESISTOR-0402  [0402]
R47  100  RESISTOR-0603  [0603]
R48  1K  RESISTOR-0603  [0603]
R49  390/0402  RESISTOR-0402  [0402]
R50  390/0402  RESISTOR-0402  [0402]
R51  390/0402  RESISTOR-0402  [0402]
R52  390/0402  RESISTOR-0402  [0402]
R55  1K/0402  RESISTOR-0402  [0402]
R56  1K/0402  RESISTOR-0402  [0402]
R57  1K/0402  RESISTOR-0402  [0402]
R58  1K/0402  RESISTOR-0402  [0402]
R59  1K/0402  RESISTOR-0402  [0402]
R60  1K/0402  RESISTOR-0402  [0402]
R61  100/0402  RESISTOR-0402  [0402]
R62  100/0402  RESISTOR-0402  [0402]
R63  100/0402  RESISTOR-0402  [0402]
R64  4.7K/0402  RESISTOR-0402  [0402]
R65  4.7K/0402  RESISTOR-0402  [0402]
R66  4.7K/0402  RESISTOR-0402  [0402]
R67  100K/0402  RESISTOR-0402  [0402]
R68  100K/0402  RESISTOR-0402  [0402]
R69  100K/0402  RESISTOR-0402  [0402]
R70  4.7K/0402  RESISTOR-0402  [0402]
R71  4.7K/0402  RESISTOR-0402  [0402]
R72  4.7K/0402  RESISTOR-0402  [0402]
RC  RED  LED-0603  [0603]
RC_POWER  ORANGE  LED-0603  [0603]
REAR_LED  RC_LIGHT  [PNHEADER_2.54_SMT_LEDLIGHT]
S1  SLIDE-SSSS810701  [SSSS810701]
T1  TRANSISTOR-NPN  [SOT-23]
T2  TRANSISTOR-NPN  [SOT-23]
T3  T2N7002AK  [SOT-23]
T4  T2N7002AK  [SOT-23]
T5  SN74LVC2G04  [SOT-23-6]
T6  SN74LVC2G04  [SOT-23-6]
T10  T2N7002AK  [SOT-23]
T11  T2N7002AK  [SOT-23]
TP1  TP-15  [TP-15]
TP2  TP-15  [TP-15]
TP3  TP-15  [TP-15]
TP4  TP-15  [TP-15]
TP5  TP-15  [TP-15]
TP6  TP-15  [TP-15]
TP7  TP-15  [TP-15]
TP8  TP-15  [TP-15]
TP9  TP-15  [TP-15]
TP10  TP-15  [TP-15]
U3  TLP291A  [11-3C1]
U7  TLP291A  [11-3C1]
U12  SSM6N7002KFU  [US6]
U20  SN74LVC1G17  [SOT-23]
U21  SSM6N7002KFU  [US6]
U23  SN74LVC1G17  [SOT-23]
U$1  RC_17PIN_OUTIN  [PNHEADER_2.54_SMT_17PIN_RC_TT01_02]
U$6  SSM6N7002KFU  [US6]
U$7  SN74LVC1G17  [SOT-23]
U$8  TLP2362  [TLP2362]
U$10  SSM6N7002KFU  [US6]
U$11  KC2016Z  [KC2016Z]
U$15  TLP2362  [TLP2362]
U$16  TLP2362  [TLP2362]
U$17  TLP2362  [TLP2362]
X2  16MHz  RESONATOR  [CSTNE_V_C]

## Nets
0: C9.1 C10.1 C11.1 C13.1 C14.1 C15.1 C16.1 C19.1 C20.1 C21.1 C22.1 IC3.8(GND) IC3.15(EN) IC5.2(GND) IC7.2(GND) R19.2 R29.1 R32.2 R33.2 R48.2 R64.1 R65.1 R66.1 R67.1 R68.1 R69.1 R70.1 R71.1 R72.1 T1.2(E) T3.2(2:SOURCE) T4.2(2:SOURCE) T6.2(GND) T10.2(2:SOURCE) T11.2(2:SOURCE) TP7.1 U12.1(1:SOURCE1) U12.4(4:SOURCE2) U20.3(GND) U21.1(1:SOURCE1) U21.4(4:SOURCE2) U23.3(GND) U$1.3:GND3(3:GND) U$1.6:GND2(6:GND) U$1.9:GND1(9:GND) U$1.13:ST_GND(13:GND) U$1.17:TH_GND(17:GND) U$7.3(GND) U$8.4(4:GND) U$10.1(1:SOURCE1) U$10.4(4:SOURCE2) U$15.4(4:GND) U$16.3(3:KATHODE) U$17.3(3:KATHODE) ; supply symbol labelled GND
3V3: C2.2 C3.2 C4.2 C5.2 C6.2 C7.1 C12.1 C18.2 C23.1 IC1.4(VCC) IC1.6(VCC) IC1.18(AVCC) IC2.1(3V3) IC2.17(3V3) IC4.28(VDD) ICSP1.2 R2.2 R22.2 R23.2 R43.2 R49.2 R50.2 T5.5(VCC) U3.4(COL) U$11.#4(4:VCC) U$16.6(6:VCC) U$17.6(6:VCC)
5V: FRONT_LED.2:POWER I2C.5V(VCC) IC2.2(5V) LED-SPI.5V(VCC) R30.2 REAR_LED.2:POWER U$8.1(1:ANODE) U$15.1(1:ANODE)
AVR_MISO: IC1.16(PB4(MISO)) ICSP1.1
AVR_MOSI: IC1.15(PB3(MOSI/OC2)) ICSP1.4 LED-SPI.DI
AVR_RESET: IC1.29(PC6(/RESET)) ICSP1.5 R2.1
AVR_RX: IC1.30(PD0(RXD)) R12.2 R45.1
AVR_SCK: IC1.17(PB5(SCK)) ICSP1.3 LED-SPI.CI
AVR_TX: IC1.31(PD1(TXD)) R13.2 R46.1
CE0: IC2.24(CE0)
D3: IC1.14(PB2(SS/OC1B)) RC.ANODE
D4: IC1.2(PD4(XCK/T0)) JETSON.ANODE
GND: C1.1 C2.1 C3.1 C4.1 C5.1 C6.1 C7.2 C8.2 C12.2 C18.1 C23.2 I2C.GND IC1.3(GND) IC1.5(AGND) IC1.21(GND) IC2.9(GND) IC2.14(GND) IC2.20(GND) IC2.25(GND) IC2.30(GND) IC2.34(GND) IC2.39(GND) IC4.1(A0) IC4.2(A1) IC4.3(A2) IC4.4(A3) IC4.5(A4) IC4.14(VSS) IC4.24(A5) ICSP1.6 LED-SPI.GND M1.2(S) M4.2(S) R1.1 R3.1 R5.1 R10.1 R17.1 R24.2 R26.1 R36.1 R41.1 R42.1 R44.1 S1.3 T2.2(E) T5.2(GND) TP3.1 U$6.1(1:SOURCE1) U$6.4(4:SOURCE2) U$11.#2(2:CASE_GND) U$16.4(4:GND) U$17.4(4:GND) X2.2
GPIO4: IC2.7(GPIO4)
GPIO5: IC2.29(GPIO5)
GPIO6: IC2.31(GPIO6)
GPIO12: IC2.32(GPIO12)
GPIO13: IC2.33(GPIO13)
GPIO16: IC2.36(GPIO16)
GPIO17: IC2.11(GPIO17)
GPIO18: IC2.12(GPIO18)
GPIO19: IC2.35(GPIO19)
GPIO20: IC2.38(GPIO20)
GPIO21: IC2.40(GPIO21)
GPIO22: IC2.15(GPIO22)
GPIO23: IC2.16(GPIO23)
GPIO24: IC2.18(GPIO24)
GPIO25: IC2.22(GPIO25)
GPIO26: IC2.37(GPIO26)
GPIO27: IC2.13(GPIO27)
IN3: R9.1 R28.2
LED0: IC4.6(LED0) R26.2 TP8.1 U$6.5(5:GATE2)
LED0_3V3: R51.1 T6.1(1A) U$8.5(5:VO)
LED0_5V: R6.2 U$6.3(3:DRAIN2)
LED0_NOT: IC3.3(B0) T6.6(1Y)
LED1: IC4.7(LED1) R17.2 TP9.1 U$6.2(2:GATE1)
LED1_3V3: R52.1 T6.3(2A) U$15.5(5:VO)
LED1_5V: R4.2 U$6.6(6:DRAIN1)
LED1_NOT: IC3.6(B1) T6.4(2Y)
MISO: IC2.21(MISO)
MOSI: IC2.19(MOSI)
N$4: C1.2 IC1.20(AREF)
N$5: IC1.8(PB7(XTAL2/TOSC2)) X2.3
N$6: R12.1 TP1.1
N$7: IC4.23(OE) R3.2
N$8: C8.1 IC4.25(EXTCLK) R1.2 U$11.#3(3:OUTPUT)
N$9: R15.2 U$17.1(1:ANODE)
N$10: R27.2 U$16.1(1:ANODE)
N$12: R7.2 U$7.4(Y)
N$15: IC1.7(PB6(XTAL1/TOSC1)) X2.1
N$16: IC1.9(PD5(T1)) S1.2
N$17: R13.1 TP2.1
N$18: R11.2 T3.1(1:GATE) T10.3(3:DRAIN)
N$19: R5.2 RC.CATHODE
N$20: JETSON.CATHODE R10.2
N$23: R6.1 U$8.3(3:KATHODE)
N$24: R4.1 U$15.3(3:KATHODE)
N$25: R25.2 U3.1(A)
N$26: T1.3(C) U3.2(C)
N$27: R28.1 R32.1 T1.1(B)
N$28: R33.1 RC_POWER.CATHODE
N$29: R35.1 R36.2 T2.1(B)
N$30: T2.3(C) U7.2(C)
N$31: C14.2 IC5.4(BYPASS)
N$33: R30.1 U7.1(A)
N$34: R47.2 R48.1 T11.1(1:GATE)
N$35: R18.2 R19.1 T10.1(1:GATE)
N$36: R20.2 T4.1(1:GATE) T11.3(3:DRAIN)
N$38: IC4.19(LED12) R37.2
N$40: R49.1 T5.1(1A) U$16.5(5:VO)
N$41: IC4.18(LED11) R38.2
N$42: R50.1 T5.3(2A) U$17.5(5:VO)
N$43: M1.1(G) R37.1 R41.2
N$44: M4.1(G) R38.1 R42.2
N$45: FRONT_LED.1:GND R39.2
N$46: M1.3(D) R39.1
N$47: M4.3(D) R40.1
N$48: R40.2 REAR_LED.1:GND
N$49: R43.1 R44.2 U$11.#1(1:INH)
N$54: D4.A(ANODE) R56.1 R70.2 U$10.3(3:DRAIN2)
N$55: D4.K(CATHODE) R64.2 U$7.2(A)
N$57: D6.A(ANODE) R58.1 R71.2 U12.3(3:DRAIN2)
N$58: D6.K(CATHODE) R65.2 U20.2(A)
N$59: R8.2 U20.4(Y)
N$60: D7.A(ANODE) R60.1 R72.2 U21.3(3:DRAIN2)
N$62: D7.K(CATHODE) R66.2 U23.2(A)
N$63: R9.2 U23.4(Y)
N$64: R61.2 R69.2 U$10.2(2:GATE1)
N$68: R63.2 R67.2 U21.2(2:GATE1)
N$69: C13.2 IC7.4(BYPASS)
N$70: C16.2 D1.1(C) IC7.1(VIN) IC7.3(ON/OFF)
N$72: R55.1 U$10.5(5:GATE2) U$10.6(6:DRAIN1)
N$73: R62.2 R68.2 U12.2(2:GATE1)
N$74: R57.1 U12.5(5:GATE2) U12.6(6:DRAIN1)
N$75: R59.1 U21.5(5:GATE2) U21.6(6:DRAIN1)
NC0: IC2.4(5V)
NC1: IC2.6(GND)
NC3: U$1.10:NC1(10:NC)
NC4: U$1.14:NC2(14:NC)
PCH1: IC3.2(A0) R7.1 R27.1 TP5.1
PCH2: IC3.5(A1) R8.1 R15.1 TP6.1
PCH3: IC1.26(PC3(ADC3)) R24.1 U3.3(EMI)
PCH6: IC3.1(SEL) R29.2 U7.3(EMI)
PCH_1: IC1.13(PB1(OC1A)) R35.2
PH1-328: IC1.32(PD2(INT0)) T5.6(1Y)
PH2_328: IC1.1(PD3(INT1)) T5.4(2Y)
RC_+B_3V3: C9.2 C10.2 C11.2 C19.2 C20.2 C22.2 IC3.16(VCC) IC7.5(VOUT) R51.2 R52.2 T6.5(VCC) TP4.1 U7.4(COL) U20.5(VCC) U23.5(VCC) U$7.5(VCC) U$8.6(6:VCC) U$15.6(6:VCC)
RC_VCC: D1.2(A) D2.A(ANODE) R55.2 R56.2 R57.2 R58.2 R59.2 R60.2 RC_POWER.ANODE U$1.2:VCC3(2:VCC) U$1.5:VCC2(5:VCC) U$1.8:VCC1(8:VCC) U$1.12:ST_VCC(12:VCC_ST) U$1.16:TH_VCC(16:VCC_TH)
RC_VCC2: BYPASS.2 C21.2 D2.C(CATHODE) IC5.1(VIN) IC5.3(ON/OFF) R11.1 R14.1 R20.1 R21.1
RCH1: IC3.4(Y0) R18.1
RCH2: IC3.7(Y1) R47.1
RX: IC2.10(RX) R46.2
SCL: I2C.SCL IC1.28(PC5(ADC5/SCL)) IC2.5(SCL) IC4.26(SCL) R22.1
SCLK: IC2.23(SCLK)
SDA: I2C.SDA IC1.27(PC4(ADC4/SDA)) IC2.3(SDA) IC4.27(SDA) R23.1
SIGNAL1_INPUT: R61.1 U$1.7:SIGNAL1(7:SIGNAL_CH1)
SIGNAL2_INPUT: R62.1 U$1.4:SIGNAL2(4:SINGNAL_CH2)
SIGNAL3_INPUT: R63.1 U$1.1:SIGNAL3(1:SIGNAL_CH3)
ST_OUTPUT: R14.2 T3.3(3:DRAIN) U$1.11:ST_SIGNAL(11:SIGNAL_ST)
TH_OUTPUT: R21.2 T4.3(3:DRAIN) U$1.15:TH_SINGNAL(15:SIGNAL_TH)
TX: IC2.8(TX) R45.2
VCC_RC1_5V: BYPASS.1 C15.2 IC5.5(VOUT) R25.1 TP10.1
Unconnected: IC1.10(PD6(AIN0)) IC1.11(PD7(AIN1)) IC1.12(PB0(ICP)) IC1.19(ADC6) IC1.22(ADC7) IC1.23(PC0(ADC0)) IC1.24(PC1(ADC1)) IC1.25(PC2(ADC2)) IC2.26(CE1) IC2.27(ID_SD) IC2.28(ID_SC) IC3.9(Y2) IC3.10(B2) IC3.11(A2) IC3.12(Y3) IC3.13(B3) IC3.14(A3) IC4.8(LED2) IC4.9(LED3) IC4.10(LED4) IC4.11(LED5) IC4.12(LED6) IC4.13(LED7) IC4.15(LED8) IC4.16(LED9) IC4.17(LED10) IC4.20(LED13) IC4.21(LED14) IC4.22(LED15) S1.1

## Notes on the sheet
- INPUT 1(ST) | INPUT 2(TH)
- INPUT 3(3ch)
- RC_AREA
- LDO 3V3
- RC_AREA
- SN74LVC1G17
- SN74LVC1G17
- SN74LVC1G17
- Rev2.0.22
- Rev 2.0.22　2022/10/22 first edition
- Rev 2.0.22_B 2022/11/09 R49,R50,R51,R52 350から390へ変更
- RC CONTROL AREA
- SPI_LED
- RC CONTROL AREA
- Arduino
- Jetson Serial
- PWM Controller
- CRISTAL OSCILLATOR(OPTION)
- ICSP
- ILUMINATION(OPTION)
- D11
- D12
- D13
- ＡＴＭＥＧＡ３２８Ｐ－ＡＵ
- option | Address 0x40
- Serial
- RC_Car Connect
- Expansion channel
- IN
- *Signal from radio control receiver
- LP2985-5
- RC CONTROL AREA | LDOバイパス
- MULTIPLEXERS | steering | OUT
- *Signal to the car body
- throttle
- MC74HC157A
- T2N7002AK
- RC CONTROL AREA
- T2N7002AK
- Jetson Nano
- I2C(OLED)
- RC CONTROL AREA
- T2N7002AK
- T2N7002AK
- ATTENTION.
  ※　TT-01 or TT-02　USE　ONLY
- 2.0.22

## Library data of the parts
BYPASS R1-R15 R17-R30 R32 R33 R35-R52 R55-R72 = FaBo-Resistors:RESISTOR: RESISTOR
C1-C8 C11-C16 C18 C21 C23 = FaBo-Capacitor:CAPACITOR: CAPACITOR
C9 C10 C19 C20 C22 = FaBo-Capacitor:CAPACITOR: CAPACITOR; SPICEPREFIX: C
D1 = Diode:DIODE_: Diode Rectifier - Popular parts; CATEGORY: Diode; DESCRIPTION: DIODE GEN PURP 100V 300MA SOD123; MANUFACTURER: Diodes Incorporated; SUB-CATEGORY: Rectifier
D2 = FaBo-Diode:CUS05F40
D4 D6 D7 = FaBo-Diode:DIODE
FRONT_LED REAR_LED = FaBo-PIN:RC_LIGHT
I2C = FaBo-Connetor:FABO-I2C
IC1 = component:ATMEGA328
IC2 = FaBo-Boards:JETSON_NANO
IC3 = FaBo-Multiplexers:MULTIPLEXERS
IC4 = FaBo-Motor:PCA9685
IC5 IC7 = FaBo-Supply:LP2985: LP2985
ICSP1 = component:ICSP_AVR
JETSON RC RC_POWER = FaBo-LED:LED
LED-SPI = FaBo-Connetor:FABO-SPI-LED
M1 M4 = FaBo-Mosfet:MOSFET-N
S1 = FaBo-Switch:SLIDE
T1 T2 = FaBo-Transistor:TRANSISTOR
T3 T4 T10 T11 = FaBo-Mosfet:T2N7002AK
T5 T6 = FaBo-Transistor:SN74LVC2G04
TP1-TP10 = FaBo-Supply:TP
U3 U7 = FaBo_Photocoupler:TLP291A
U12 U21 U$6 U$10 = FaBo-Mosfet:SSM6N7002KFU
U20 U23 U$7 = FaBo-LogicIC:SN74LVC1G17
U$1 = FaBo-PIN:RC_17PIN_OUTIN
U$8 U$15-U$17 = FaBo-Photocoupler:TLP2362: TLP2362 Inverter logic Open Collector 10Mbps 6-soic
U$11 = FaBo-Crystal:KC2016Z
X2 = component:RESONATOR